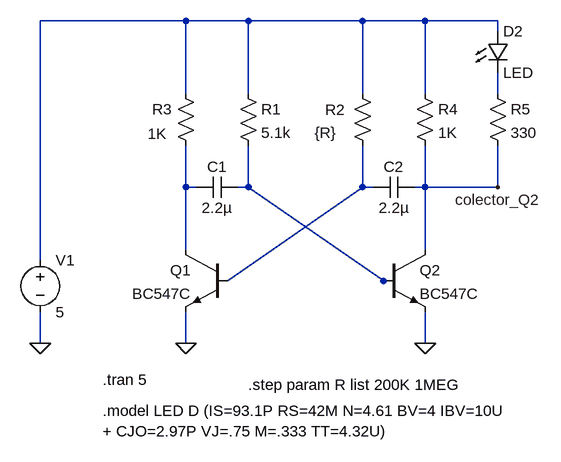
[diagram p0: schematic detector-mentiras.asc]
detector-mentiras.asc, the LTspice schematic file:
Version 4
SHEET 1 1236 680
WIRE 16 -816 -208 -816
WIRE 112 -816 16 -816
WIRE 288 -816 112 -816
WIRE 384 -816 288 -816
WIRE 496 -816 384 -816
WIRE 496 -800 496 -816
WIRE 16 -704 16 -816
WIRE 112 -704 112 -816
WIRE 288 -704 288 -816
WIRE 384 -704 384 -816
WIRE 496 -704 496 -736
WIRE 16 -560 16 -624
WIRE 32 -560 16 -560
WIRE 112 -560 112 -624
WIRE 112 -560 96 -560
WIRE 288 -560 288 -624
WIRE 304 -560 288 -560
WIRE 384 -560 384 -624
WIRE 384 -560 368 -560
WIRE 496 -560 496 -624
WIRE 496 -560 384 -560
WIRE 16 -464 16 -560
WIRE 384 -464 384 -560
WIRE -208 -448 -208 -816
WIRE 80 -416 288 -560
WIRE 320 -416 112 -560
WIRE 336 -416 320 -416
WIRE -208 -320 -208 -368
WIRE 16 -320 16 -368
WIRE 384 -320 384 -368
FLAG 16 -320 0
FLAG -208 -320 0
FLAG 384 -320 0
FLAG 496 -560 colector_Q2
SYMBOL npn 320 -464 R0
SYMATTR InstName Q2
SYMATTR Value BC547C
SYMBOL res 368 -720 R0
SYMATTR InstName R4
SYMATTR Value 1K
SYMBOL res 0 -720 R0
WINDOW 0 -36 40 Left 2
WINDOW 3 -43 78 Left 2
SYMATTR InstName R3
SYMATTR Value 1K
SYMBOL res 96 -720 R0
SYMATTR InstName R1
SYMATTR Value 5.1k
SYMBOL res 272 -720 R0
WINDOW 0 -42 41 Left 2
WINDOW 3 -58 76 Left 2
SYMATTR InstName R2
SYMATTR Value {R}
SYMBOL cap 96 -576 R90
WINDOW 0 0 32 VBottom 2
WINDOW 3 32 32 VTop 2
SYMATTR InstName C1
SYMATTR Value 2.2µ
SYMBOL cap 368 -576 R90
WINDOW 0 0 32 VBottom 2
WINDOW 3 32 32 VTop 2
SYMATTR InstName C2
SYMATTR Value 2.2µ
SYMBOL voltage -208 -464 R0
WINDOW 123 0 0 Left 0
WINDOW 39 0 0 Left 0
SYMATTR InstName V1
SYMATTR Value 5
SYMBOL npn 80 -464 M0
SYMATTR InstName Q1
SYMATTR Value BC547C
SYMBOL LED 480 -800 R0
SYMATTR InstName D2
SYMATTR Value LED
SYMBOL res 480 -720 R0
SYMATTR InstName R5
SYMATTR Value 330
TEXT -112 -264 Left 2 !.tran 5
TEXT -112 -216 Left 2 !.model LED D (IS=93.1P RS=42M N=4.61 BV=4 IBV=10U\n+ CJO=2.97P VJ=.75 M=.333 TT=4.32U)
TEXT 112 -256 Left 2 !.step param R list 200K 1MEG

The netlist it stands for:
* detector-mentiras.asc
Q2 colector_Q2 N004 0 0 BC547C
R4 N001 colector_Q2 1K
R3 N001 N003 1K
R1 N001 N004 5.1k
R2 N001 N005 {R}
C1 N004 N003 2.2µ
C2 colector_Q2 N005 2.2µ
V1 N001 0 5
Q1 N003 N005 0 0 BC547C
D2 N001 N002 LED
R5 N002 colector_Q2 330
.model D D
.lib standard.dio
.model NPN NPN
.model PNP PNP
.lib standard.bjt
.tran 5
.model LED D (IS=93.1P RS=42M N=4.61 BV=4 IBV=10U
+ CJO=2.97P VJ=.75 M=.333 TT=4.32U)
.step param R list 200K 1MEG
.backanno
.end